# Altium schematic sheet 5_hardware.SchDoc
size A4
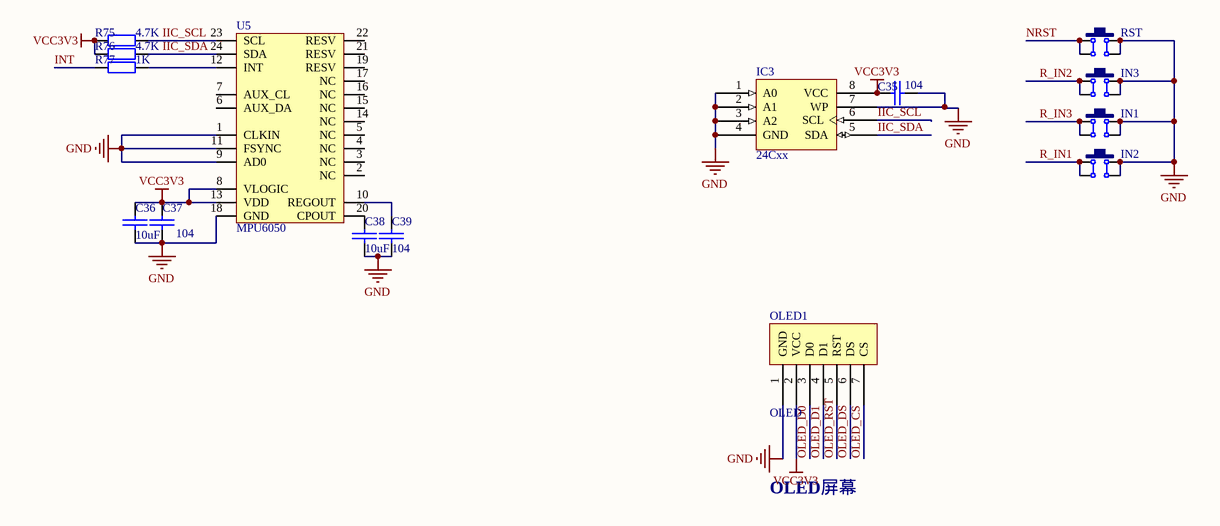
[diagram p0: 5_hardware.SchDoc]

## Parts
C35  104  [LC-0603_C]
C36  10uF  [LC-0805_C]
C37  104  [LC-0603_C]
C38  10uF  [LC-0805_C]
C39  104  [LC-0603_C]
IC3  24Cxx  [SOP8_M]
IN1  6x6x5  [TSW DIP-6*6*6]  (value not drawn)
IN2  6x6x5  [TSW DIP-6*6*6]  (value not drawn)
IN3  6x6x5  [TSW DIP-6*6*6]  (value not drawn)
OLED1  OLED  [OLED-0.96]
R75  4.7K  [LC-0603_R]
R76  4.7K  [LC-0603_R]
R77  1K  [LC-0603_R]
RST  6x6x5  [TSW DIP-6*6*6]  (value not drawn)
U5  MPU6050  [QFN24 4x4_M]

## Nets
GND: C35.1 C36.1 C37.1 C38.1 C39.2 IC3.1(A0) IC3.2(A1) IC3.3(A2) IC3.4(GND) IC3.7(WP) IN1.2 IN1.3 IN2.2 IN2.3 IN3.2 IN3.3 OLED1.1(GND) RST.2 RST.3 U5.1(CLKIN) U5.9(AD0) U5.11(FSYNC) U5.18(GND)
VCC3V3: C35.2 C36.2 C37.2 IC3.8(VCC) OLED1.2(VCC) R75.2 R76.2 U5.8(VLOGIC) U5.13(VDD)
IIC_SCL: IC3.6(SCL) R75.1 U5.23(SCL)
IIC_SDA: IC3.5(SDA) R76.1 U5.24(SDA)
INT: R77.2
NRST: RST.1 RST.4
OLED_CS: OLED1.7(CS)
OLED_D0: OLED1.3(D0)
OLED_D1: OLED1.4(D1)
OLED_DS: OLED1.6(DS)
OLED_RST: OLED1.5(RST)
R_IN1: IN2.1 IN2.4
R_IN2: IN3.1 IN3.4
R_IN3: IN1.1 IN1.4
NetC38_2: C38.2 U5.20(CPOUT)
NetC39_1: C39.1 U5.10(REGOUT)
NetR77_1: R77.1 U5.12(INT)

Not connected (* = marked no-connect by the designer): U5 2(NC) 3(NC) 4(NC) 5(NC) 6(AUX_DA) 7(AUX_CL) 14(NC) 15(NC) 16(NC) 17(NC) 19(RESV) 21(RESV) 22(RESV)

## Notes on the sheet
- OLED屏幕

## Library data of the parts
C35-C39 = 0805C: Capacitor 0805
IC3 = 24Cxx: 外置EEPROM; 版权归属: 源创客; BOM名称: 外置EEPROM; 学习资源: www.ooocke.com
IN1-IN3 RST = TSW DIP-6x6: 直插6x6轻触开关; 版权归属: 源创客; BOM名称: 直插6x6轻触开关; 学习资源: www.ooocke.com
OLED1 = OLED_SPI: OLED屏幕
R75 R76 = Res1: 贴片电阻; Value: 1K; Published: 8-Jun-2000; LatestRevisionDate: 17-Jul-2002; LatestRevisionNote: Re-released for DXP Platform.; PackageReference: AXIAL-0.4; Publisher: Altium Limited
R77 = Res1: 贴片电阻; Published: 8-Jun-2000; LatestRevisionDate: 17-Jul-2002; LatestRevisionNote: Re-released for DXP Platform.; PackageReference: AXIAL-0.4; Publisher: Altium Limited; Value: 1K
U5 = MPU6050: 9轴运动处理传感器